# Altium schematic sheet CoolantMonitor_Interconnect.SchDoc
size A
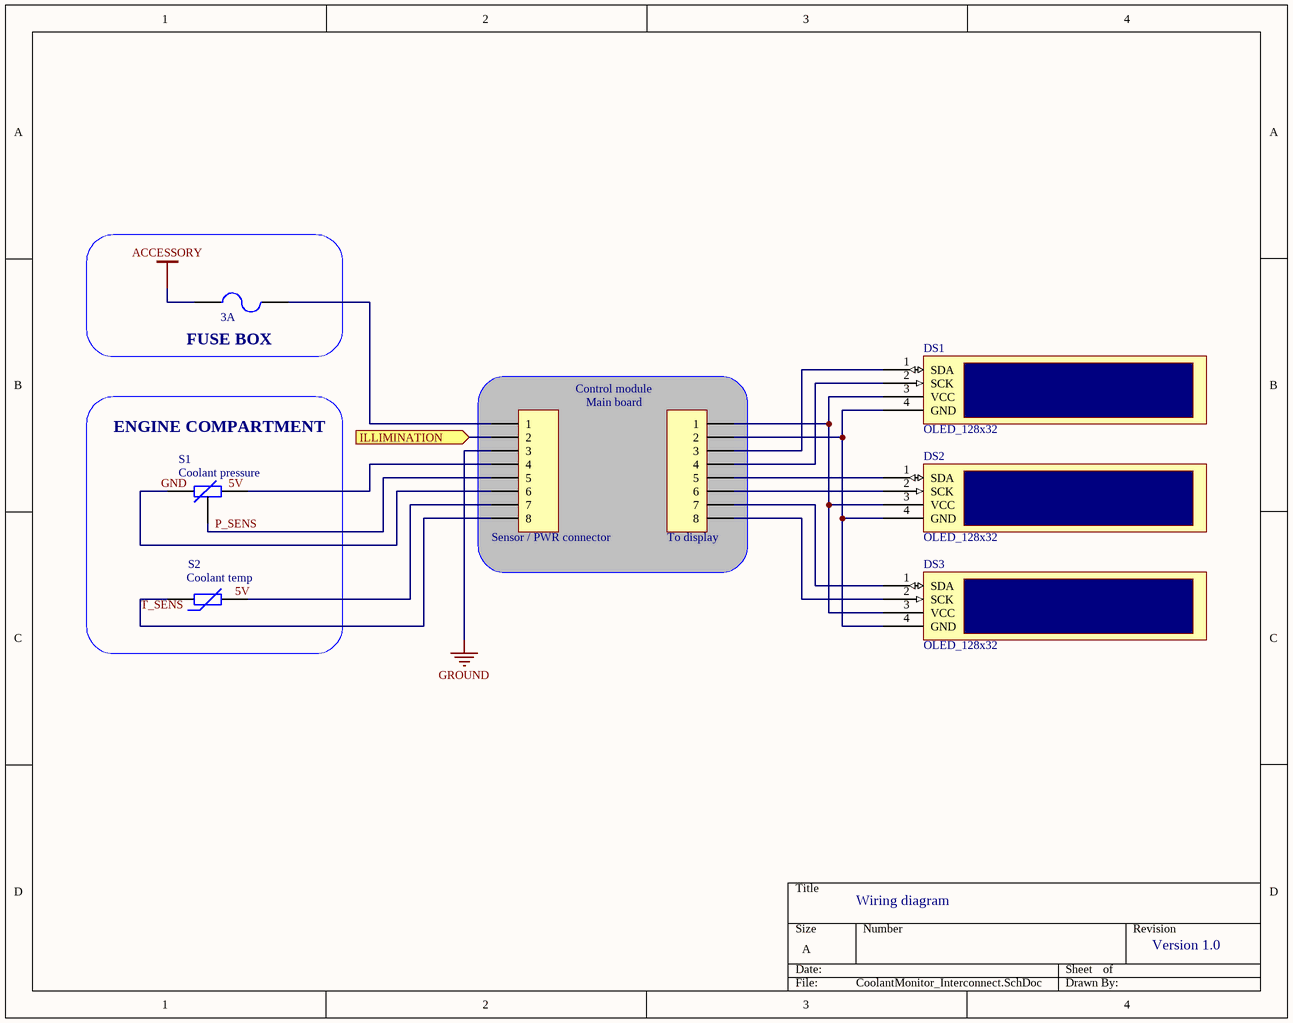
[diagram p0: CoolantMonitor_Interconnect.SchDoc]

## Parts
(Parts that share a designator on the sheet are numbered #1, #2 ... from top to bottom, then left to right.)
?#1  3A  [PIN-W2/E2.8]
?#2  Sensor / PWR connector  [HDR1X8]
?#3  To display  [HDR1X8]
DS1  OLED_128x32
DS2  OLED_128x32
DS3  OLED_128x32
S1  Coolant pressure
S2  Coolant temp  [6-0805_L]

## Blocks framed on the sheet
FUSE BOX: ?#1
ENGINE COMPARTMENT: S1 S2

## Ports
ILLIMINATION (in)

## Nets
ACCESSORY: ?#1.1
GROUND: ?#2.3
GND: ?#2.6 S1.2
ILLIMINATION: ?#2.2 ; port ILLIMINATION
P_SENS: ?#2.5
T_SENS: ?#2.8 S2.1
Net?#1_2: ?#1.2 ?#2.1
Net?#2_4: ?#2.4 S1.1
Net?#2_7: ?#2.7 S2.2
Net?#3_1: ?#3.1 DS1.3(VCC) DS2.3(VCC) DS3.3(VCC)
Net?#3_2: ?#3.2 DS1.4(GND) DS2.4(GND) DS3.4(GND)
Net?#3_3: ?#3.3 DS1.1(SDA)
Net?#3_4: ?#3.4 DS1.2(SCK)
Net?#3_5: ?#3.5 DS2.1(SDA)
Net?#3_6: ?#3.6 DS2.2(SCK)
Net?#3_7: ?#3.7 DS3.1(SDA)
Net?#3_8: ?#3.8 DS3.2(SCK)

Not connected (* = marked no-connect by the designer): S1 3

## Notes on the sheet
- Control module
- Main board
- Wiring diagram
- Version 1.0
- Labels drawn without touching a wire or pin: 5V

## Library data of the parts
?#1 = Fuse 2: Fuse; Published: 8-Jun-2000; LatestRevisionDate: 17-Jul-2002; LatestRevisionNote: Re-released for DXP Platform.; PackageReference: PIN-W2/E2.8; Publisher: Altium Limited; PackageDescription: Thru-Hole; 2 Leads
?#2 ?#3 = Header 8: Header, 8-Pin; LatestRevisionDate: 17-Jul-2002; LatestRevisionNote: Re-released for DXP Platform.; Publisher: Altium Limited
S1 = TEMP_SENSOR
S2 = Res Varistor: Varistor (Voltage-Sensitive Resistor); Published: 24-Mar-1999; LatestRevisionDate: 29-May-2009; LatestRevisionNote: IPC-7351 Footprint Added.; PackageVersion: Mar-2003; PackageReference: 6-0805; Publisher: Altium Limited; PackageDescription: Chip Resistor 0805 Case Size; Code_IPC: RESC2012